# Altium schematic sheet FlipDot_Matrix.SchDoc: Lab. Proj. PCB
size A4; Author: Tomasz Machnik; Revision: 1; SheetNumber: 6; SheetTotal: 7
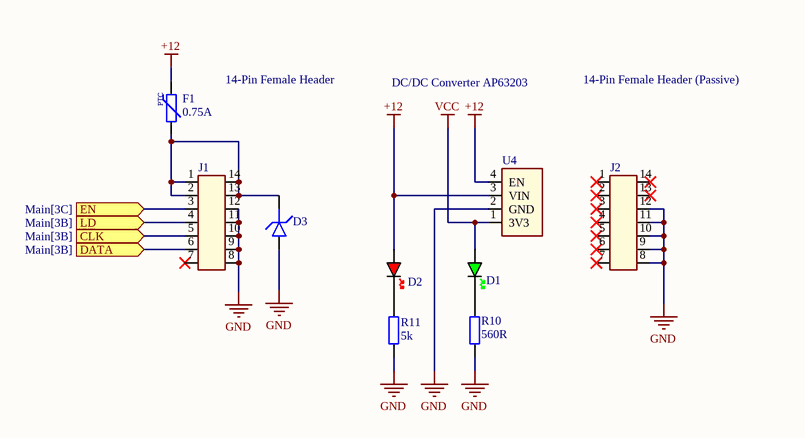
[diagram p0: FlipDot_Matrix.SchDoc]

## Parts
D1  GREEN  [LED_0603_GREEN]  (value not drawn)
D2  RED  [LED_0603_RED]  (value not drawn)
D3  D_TVS_0402  [D_0402]  (value not drawn)
F1  0.75A  [FUSE_1206]
J1  14-Pin Female Header  [SAMTEC_14_PIN]
J2  14-Pin Female Header (Passive)  [SAMTEC_14_PIN]
R10  560R  [RES_0805]
R11  5k  [RES_0805]
U4  DC/DC Converter AP63203  [DC/DC_CONVERTER]

## Ports
CLK (in, see Main[3B]), DATA (in, see Main[3B]), EN (in, see Main[3C]), LD (in, see Main[3B])

## Nets
+12: D2.A F1.2 U4.3(VIN) U4.4(EN)
GND: D3.A J1.8 J1.9 J1.10 J1.11 J1.12 J2.8 J2.9 J2.10 J2.11 J2.12 R10.1 R11.1 U4.2(GND)
VCC: D1.A U4.1(3V3)
CLK: J1.5 ; port CLK
DATA: J1.6 ; port DATA
EN: J1.3 ; port EN
LD: J1.4 ; port LD
NetD1_K: D1.K R10.2
NetD2_K: D2.K R11.2
NetD3_K: D3.K F1.1 J1.1 J1.2 J1.13 J1.14

Not connected (* = marked no-connect by the designer): J1 7*; J2 1* 2* 3* 4* 5* 6* 7* 13* 14*

## Notes on the sheet
- Title:
- Author:
- Approved:
- Size:
- Date:
- Git Hash:
- A4
- Prj:
- SW Version:
- Variant:
- Edited:
- CONFIDENTIAL
- File:
- (in symbol FUSE_PPTC_1206) PTC

## Library data of the parts
D1 = LED_0603_GREEN: LED 0603 GREEN SMD
D2 = LED_0603_RED: LED 0603 RED SMD
D3 = D_TVS_0402: Diode TVS / ESD 0402
F1 = FUSE_PPTC_1206: Fuse PPTC SMD 1206; Manufacturer: *; Manufacturer Part Number: *
J1 J2 = 14-Pin-Connector
R10 R11 = RES_0805: Resistor SMD 0805; Manufacturer: *; Manufacturer Part Number: *; Distributor Link: *; LCSC: *